# EAGLE design EthernetShield (EAGLE 6.5.0)
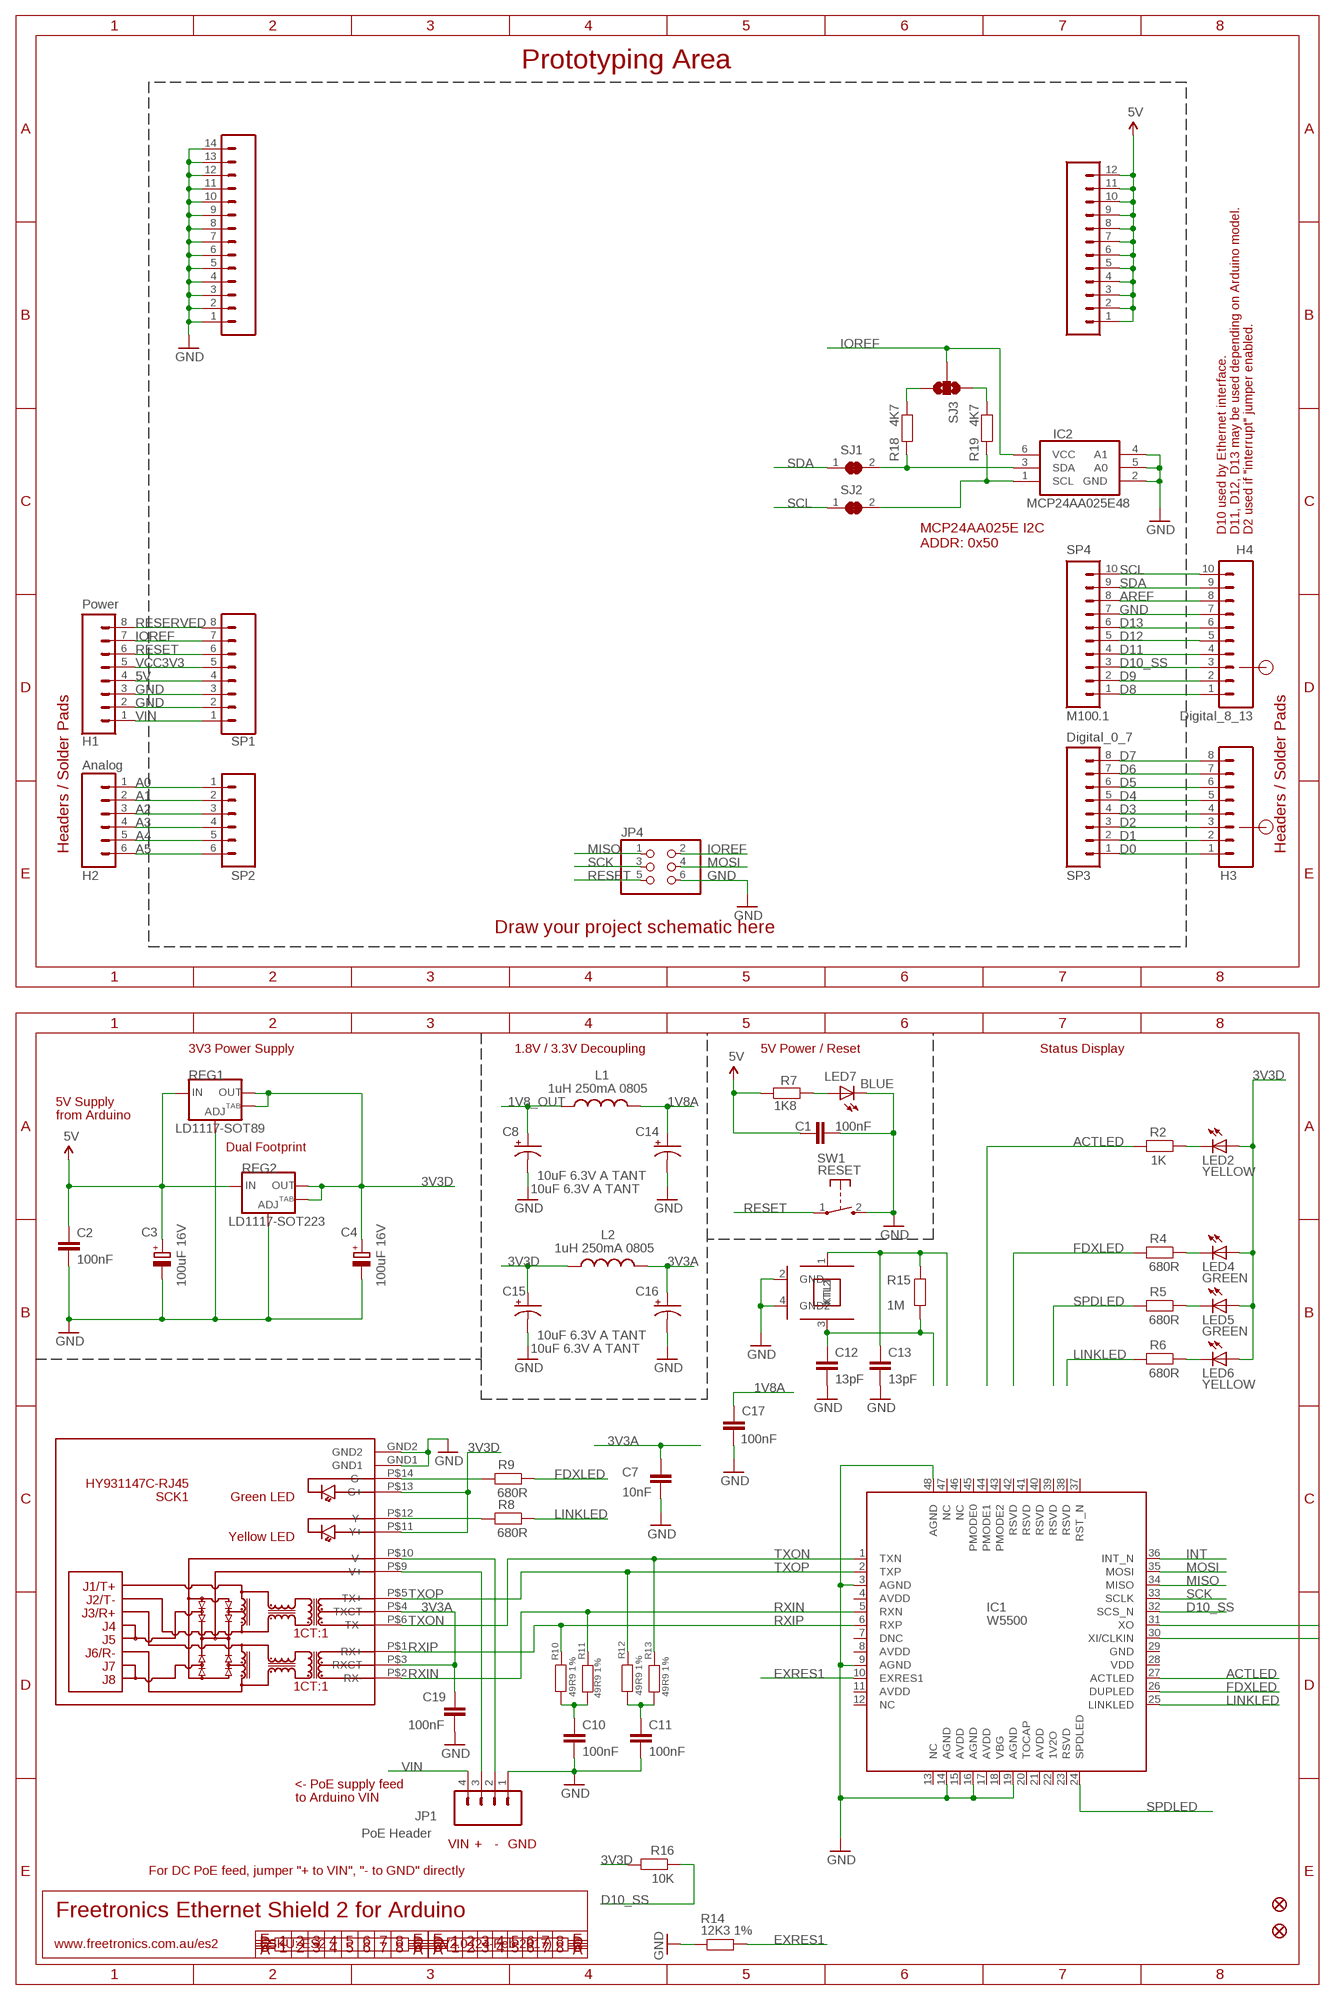
[diagram p0: schematic, sheet 1]

## Parts
C1  100nF  CAP0603  [0603]
C2  100nF  CAP0603  [0603]
C3  100uF 16V  CPOL-EUD  [PANASONIC_D]
C4  100uF 16V  CPOL-EUD  [PANASONIC_D]
C7  10nF  CAP0603  [0603]
C8  10uF 6.3V A TANT  CAP_POL1206  [EIA3216]
C10  100nF  CAP0603  [0603]
C11  100nF  CAP0603  [0603]
C12  13pF  CAP0603  [0603]
C13  13pF  CAP0603  [0603]
C14  10uF 6.3V A TANT  CAP_POL1206  [EIA3216]
C15  10uF 6.3V A TANT  CAP_POL1206  [EIA3216]
C16  10uF 6.3V A TANT  CAP_POL1206  [EIA3216]
C17  100nF  CAP0603  [0603]
C19  100nF  CAP0603  [0603]
H1  Power  M08  [1X08]
H2  Analog  M06SIP  [1X06]
H3  Digital_0_7  M08  [1X08]
H4  Digital_8_13  M100.1  [1X10]
IC1  W5500  [W5500]
IC2  MCP24AA025E48  [SOT23-6]
JP1  PoE Header  M04PTH  [1X04]
JP4  PINHD-2X3  [2X03]
L1  1uH 250mA 0805  L-USL2012C  [L2012C]
L2  1uH 250mA 0805  L-USL2012C  [L2012C]
LED2  YELLOW  LED0603  [LED-0603]
LED4  GREEN  LED0603  [LED-0603]
LED5  GREEN  LED0603  [LED-0603]
LED6  YELLOW  LED0603  [LED-0603]
LED7  BLUE  LED0603  [LED-0603]
PADS_5V  M12PTH  [1X12]
PADS_GND  M14  [1X14]
R2  1K  RESISTOR0603  [0603]
R4  680R  RESISTOR0603  [0603]
R5  680R  RESISTOR0603  [0603]
R6  680R  RESISTOR0603  [0603]
R7  1K8  RESISTOR0603  [0603]
R8  680R  RESISTOR0603  [0603]
R9  680R  RESISTOR0603  [0603]
R10  49R9 1%  RESISTOR0603  [0603]
R11  49R9 1%  RESISTOR0603  [0603]
R12  49R9 1%  RESISTOR0603  [0603]
R13  49R9 1%  RESISTOR0603  [0603]
R14  12K3 1%  RESISTOR0603  [0603]
R15  1M  RESISTOR0603  [0603]
R16  10K  RESISTOR0603  [0603]
R18  4K7  RESISTOR0603  [0603]
R19  4K7  RESISTOR0603  [0603]
REG1  LD1117-SOT89  V_REG_LM1117SOT89  [SOT89]
REG2  LD1117-SOT223  V_REG_LM1117SOT223  [SOT223]
SCK1  HY931147C-RJ45  [HY931147C]
SJ1  SJCN  [SJC]
SJ2  SJCN  [SJC]
SJ3  SOLDERJUMPER_2WAYT  [SJ_2]
SP1  M08  [1X08]
SP2  Analog  M06SIP  [1X06]
SP3  Digital_0_7  M08  [1X08]
SP4  M100.1  [1X10]
SW1  RESET  TAC_SWITCH_2PIN  [TACTILE_SWITCH_SMD_2PIN_TINY]
U$6  FIDUCIAL1X2.5  [FIDUCIAL-1X2.5]
U$8  FIDUCIAL1X2.5  [FIDUCIAL-1X2.5]
XTL1  25MHZ  CRYSTAL-GND3X2  [CRYSTAL-SMD-3X2]

## Nets
1V8_OUT: C8.A(+) L1.1
1V8A: C14.A(+) C17.1 L1.2
3V3A: C7.1 C16.A(+) C19.1 L2.2 SCK1.P$3(RXCT) SCK1.P$4(TXCT)
3V3D: C4.+ C15.A(+) L2.1 LED2.A LED4.A LED5.A LED6.A R16.2 REG1.2(OUT) REG1.4(OUT) REG2.2(OUT) REG2.4(OUT) SCK1.P$11(Y+) SCK1.P$13(G+)
5V: C1.1 C2.1 C3.+ H1.4 PADS_5V.1 PADS_5V.2 PADS_5V.3 PADS_5V.4 PADS_5V.5 PADS_5V.6 PADS_5V.7 PADS_5V.8 PADS_5V.9 PADS_5V.10 PADS_5V.11 PADS_5V.12 R7.1 REG1.3(IN) REG2.3(IN) SP1.4
A0: H2.1 SP2.1
A1: H2.2 SP2.2
A2: H2.3 SP2.3
A3: H2.4 SP2.4
A4: H2.5 SP2.5
A5: H2.6 SP2.6
ACTLED: IC1.27(ACTLED) R2.2
AREF: H4.8 SP4.8
D0: H3.1 SP3.1
D1: H3.2 SP3.2
D2: H3.3 SP3.3
D3: H3.4 SP3.4
D4: H3.5 SP3.5
D5: H3.6 SP3.6
D6: H3.7 SP3.7
D7: H3.8 SP3.8
D8: H4.1 SP4.1
D9: H4.2 SP4.2
D10_SS: H4.3 IC1.32(SCS_N) R16.1 SP4.3
D11: H4.4 SP4.4
D12: H4.5 SP4.5
D13: H4.6 SP4.6
EXRES1: IC1.10(EXRES1) R14.2
FDXLED: IC1.26(DUPLED) R4.2 R9.1
GND: C1.2 C2.2 C3.- C4.- C7.2 C8.C(-) C10.2 C11.2 C12.2 C13.2 C14.C(-) C15.C(-) C16.C(-) C17.2 C19.2 H1.2 H1.3 H4.7 IC1.3(AGND) IC1.9(AGND) IC1.14(AGND) IC1.16(AGND) IC1.19(AGND) IC1.48(AGND) IC2.2(GND) IC2.4(A1) IC2.5(A0) JP1.1 JP4.6 LED7.C PADS_GND.1 PADS_GND.2 PADS_GND.3 PADS_GND.4 PADS_GND.5 PADS_GND.6 PADS_GND.7 PADS_GND.8 PADS_GND.9 PADS_GND.10 PADS_GND.11 PADS_GND.12 PADS_GND.13 PADS_GND.14 R14.1 REG1.1(ADJ) REG2.1(ADJ) SCK1.GND1 SCK1.GND2 SP1.2 SP1.3 SP4.7 SW1.2(S) XTL1.2(GND) XTL1.4(GND2)
INT: IC1.36(INT_N)
IOREF: H1.7 IC2.6(VCC) JP4.2 SJ3.2 SP1.7
LINKLED: IC1.25(LINKLED) R6.2 R8.1
MISO: IC1.34(MISO) JP4.1
MOSI: IC1.35(MOSI) JP4.4
N$1: C11.1 R12.1 R13.2
N$2: IC2.1(SCL) R19.2 SJ2.2
N$6: IC2.3(SDA) R18.2 SJ1.2
N$7: R18.1 SJ3.3
N$53: R19.1 SJ3.1
N$66: IC1.31(XO)
N$67: R9.2 SCK1.P$14(G-)
N$68: JP1.3 SCK1.P$9(V+)
N$69: JP1.2 SCK1.P$10(V-)
N$71: IC1.30(XI/CLKIN)
N$131: LED7.A R7.2
N$321: C10.1 R10.1 R11.2
N$323: LED5.C R5.1
N$325: LED6.C R6.1
N$327: LED4.C R4.1
N$329: LED2.C R2.1
N$332: R8.2 SCK1.P$12(Y-)
RESERVED: H1.8 SP1.8
RESET: H1.6 JP4.5 SP1.6 SW1.1(P)
RXIN: IC1.5(RXN) R11.1 SCK1.P$2(RX-)
RXIP: IC1.6(RXP) R10.2 SCK1.P$1(RX+)
SCK: IC1.33(SCLK) JP4.3
SCL: H4.10 SJ2.1 SP4.10
SDA: H4.9 SJ1.1 SP4.9
SPDLED: IC1.24(SPDLED) R5.2
TXON: IC1.1(TXN) R13.1 SCK1.P$6(TX-)
TXOP: IC1.2(TXP) R12.2 SCK1.P$5(TX+)
VCC3V3: H1.5 SP1.5
VIN: H1.1 JP1.4 SP1.1
XTLN: C13.1 R15.2 XTL1.1(XTL1)
XTLP: C12.1 R15.1 XTL1.3(XTL2)
Unconnected: IC1.4(AVDD) IC1.7(DNC) IC1.8(AVDD) IC1.11(AVDD) IC1.12(NC) IC1.13(NC) IC1.15(AVDD) IC1.17(AVDD) IC1.18(VBG) IC1.20(TOCAP) IC1.21(AVDD) IC1.22(1V2O) IC1.23(RSVD) IC1.28(VDD) IC1.29(GND) IC1.37(RST_N) IC1.38(RSVD) IC1.39(RSVD) IC1.40(RSVD) IC1.41(RSVD) IC1.42(RSVD) IC1.43(PMODE2) IC1.44(PMODE1) IC1.45(PMODE0) IC1.46(NC) IC1.47(NC)

## Notes on the sheet
- Prototyping Area
- D10 used by Ethernet interface. | D11, D12, D13 may be used depending on Arduino model. | D2 used if "interrupt" jumper enabled.
- MCP24AA025E I2C
  ADDR: 0x50
- Headers / Solder Pads | Headers / Solder Pads
- Draw your project schematic here
- 3V3 Power Supply | 1.8V / 3.3V Decoupling | 5V Power / Reset | Status Display
- 5V Supply
- from Arduino
- Dual Footprint
- <- PoE supply feed
- to Arduino VIN
- VIN | + | - | GND
- For DC PoE feed, jumper "+ to VIN", "- to GND" directly
- Freetronics Ethernet Shield 2 for Arduino
- www.freetronics.com.au/es2 | SKU: ES2 | V2.0 (24-Feb-2017)

## Library data of the parts
C1 C2 C7 C10-C13 C17 C19 = freetronics:CAP: Capacitor Standard 0603 ceramic capacitor, and 0.1" leaded capacitor.
C3 C4 = rcl:CPOL-EU: POLARIZED CAPACITOR, European symbol
C8 C14-C16 = freetronics:CAP_POL: Capacitor Polarized These are standard SMD and PTH capacitors. Normally 10uF, 47uF, and 100uF in electrolytic and tantalum varieties. Always verify the external diameter of the through hole cap, it varies with capacity, voltage, and manufacturer. The EIA devices should be standard.
H1 H3 SP1 SP3 = freetronics:M08: Header 8 Standard 8-pin 0.1" header. Use with straight break away headers (SKU : PRT-00116), right angle break away headers (PRT-00553), swiss pins (PRT-00743), machine pins (PRT-00117), and female headers (PRT-00115).
H2 SP2 = freetronics:M06: Header 6 Standard 6-pin 0.1" header. Use with straight break away headers (SKU : PRT-00116), right angle break away headers (PRT-00553), swiss pins (PRT-00743), machine pins (PRT-00117), and female headers (PRT-00115). Molex polarized connector foot print use with SKU : PRT-08094 with associated crimp pins and housings. NOTES ON THE VARIANTS LOCK and LOCK_LONGPADS... This footprint was designed to help hold the alignment of a through-hole component (i.e. 6-pin header) while soldering it into place. You may notice that each hole has been shifted either up or down by 0.005 of an inch from it's more standard position (which is a perfectly straight line). This slight alteration caused the pins (the squares in the middle) to touch the edges of the holes. Because they are alternating, it causes a "brace" to hold the component in place. 0.005 has proven to be the perfect amount of "off-center" position when using our standard breakaway headers. Although looks a little odd when you look at the bare footprint, once you have a header in there, the alteration is very hard to notice. Also, if you push a header all the way into place, it is covered up entirely on the bottom side. This idea of altering the position of holes to aid alignment will be further integrated into the Sparkfun Library for other footprints. It can help hold any component with 3 or more connection pins.
H4 SP4 = freetronics-original:M10: Header 10 Standard 10-pin 0.1" header. Use with straight break away headers (SKU : PRT-00116), right angle break away headers (PRT-00553), swiss pins (PRT-00743), machine pins (PRT-00117), and female headers (PRT-00115).
IC1 = W5500:W5500
IC2 = freetronics-jon:MCP24AA025E48
JP1 = freetronics:M04: Header 4 Standard 4-pin 0.1" header. Use with straight break away headers (SKU : PRT-00116), right angle break away headers (PRT-00553), swiss pins (PRT-00743), machine pins (PRT-00117), and female headers (PRT-00115). Molex polarized connector foot print use with SKU : PRT-08231 with associated crimp pins and housings.
JP4 = freetronics-master-v1.1:PINHD-2X3: PIN HEADER
L1 L2 = rcl:L-US: INDUCTOR, American symbol
LED2 LED4-LED7 = freetronics:LED: LEDs Standard schematic elements and footprints for 5mm, 3mm, 1206, and 0603 sized LEDs. 5mm - Spark Fun Electronics SKU : COM-00529 (and others)
PADS_5V = freetronics-original:M12: Header 12 Standard 12-pin 0.1" header. Use with straight break away headers (SKU : PRT-00116), right angle break away headers (PRT-00553), swiss pins (PRT-00743), machine pins (PRT-00117), and female headers (PRT-00115).
PADS_GND = freetronics:M14: Header 14 Standard 14-pin 0.1" header. Use with straight break away headers (SKU : PRT-00116), right angle break away headers (PRT-00553), swiss pins (PRT-00743), machine pins (PRT-00117), and female headers (PRT-00115).
R2 R4-R16 = freetronics:RESISTOR: Resistor Basic schematic elements and footprints for 0603, 1206, and PTH 1/10th watt (small) resistors.
R18 R19 = freetronics-master-v1.1:RESISTOR: Resistor Basic schematic elements and footprints for 0603, 1206, and PTH 1/10th watt (small) resistors.
REG1 REG2 = freetronics:V_REG_LM1117: Voltage Regulator LD1117 Adjustable low-dropout voltage regulator available in SOT89 and SOT223 SMT packages.
SCK1 = freetronics-jon:HY931147C
SJ1 SJ2 = freetronics-jon:SJC
SJ3 = freetronics-original:SOLDERJUMPER_2WAY: Solder Jumper 2 way solder jumper
SW1 = freetronics-master-v1:TAC_SWITCH_2PIN: Momentary Tactile Switch - 2 pin
U$6 U$8 = freetronics:FIDUCIAL: Fiducial Alignment Points Various fiducial points for machine vision alignment.
XTL1 = freetronics-jon:CRYSTAL-GND

## Board
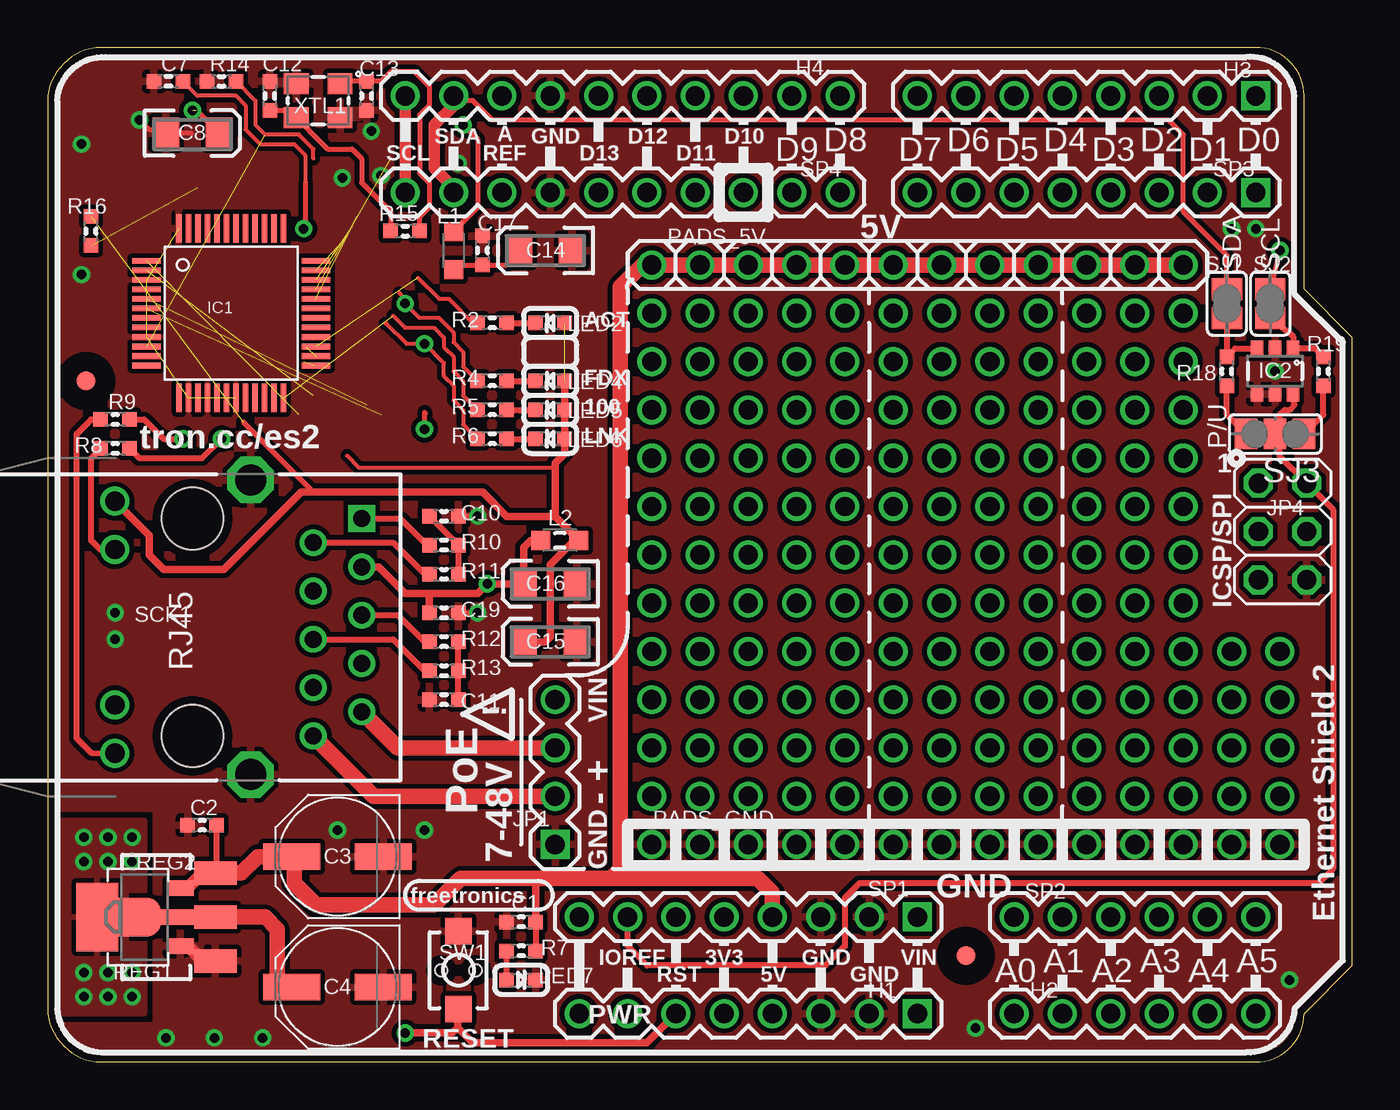
[diagram p1: board, top side]
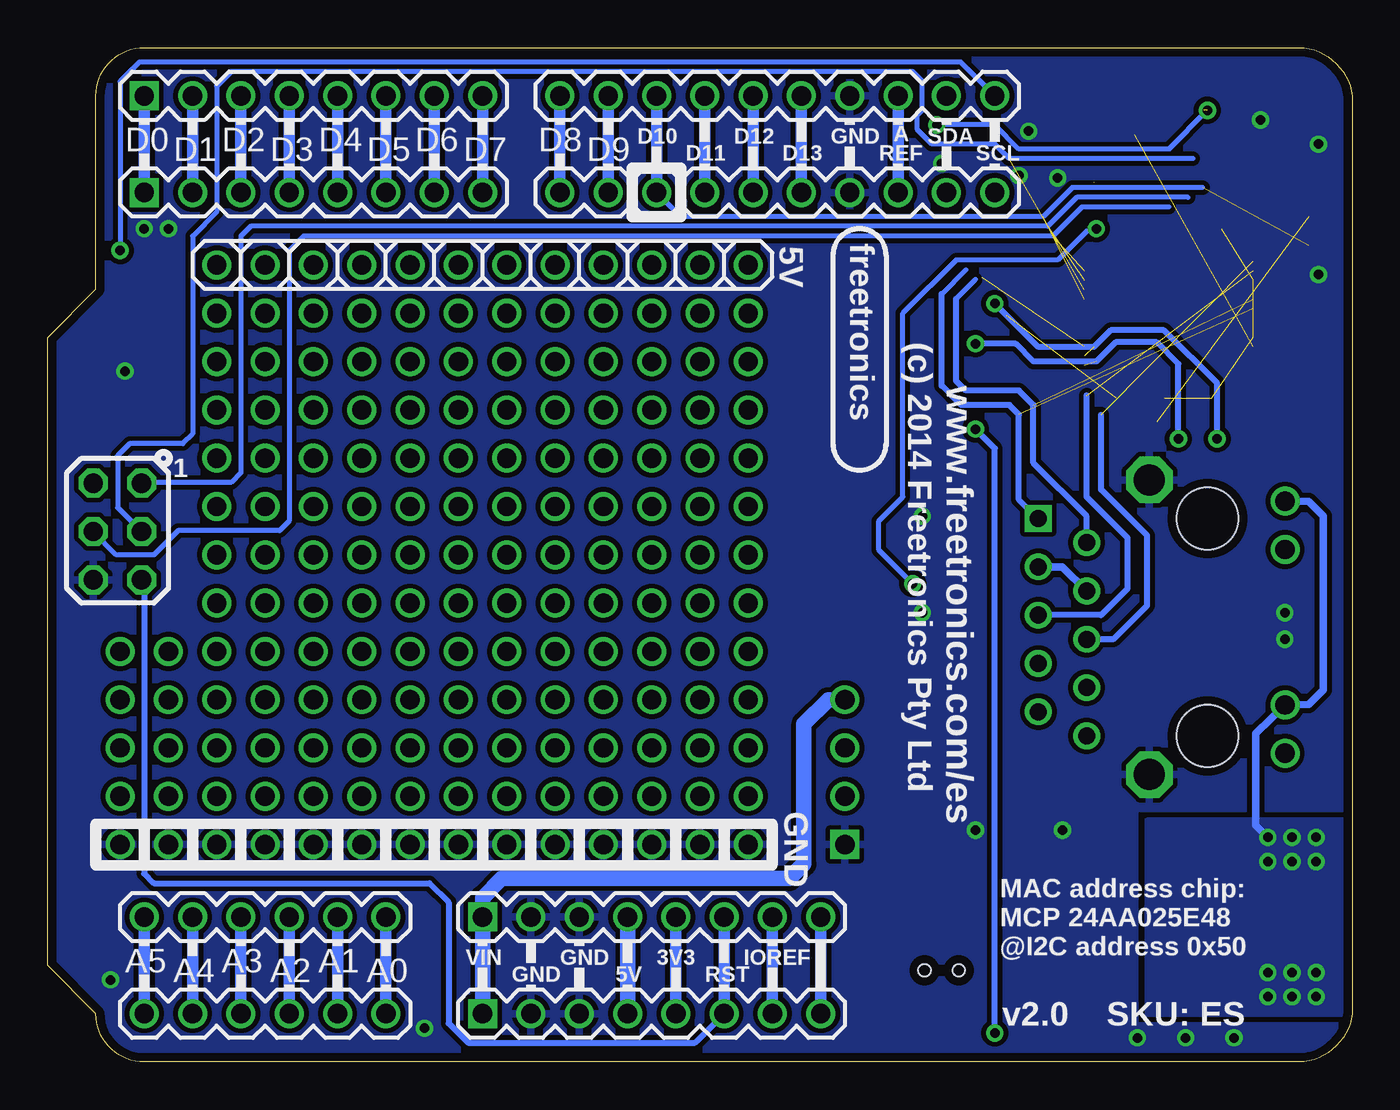
[diagram p2: board, bottom side, seen from below]

Size 68.58 x 53.34 mm. Coordinates in mm from the lower left corner, seen from the top.
Outline: 0,2.54 arc74 2.54,0 63.5,0 arc90 66.04,2.54 68.58,5.08 68.58,38.1 66.04,40.64 66.04,50.8 arc90 63.5,53.34 2.54,53.34 arc74 0,50.8 0,2.54
Copper layers (1*16): Top 0.035mm / dielectric 1.5mm / Bottom 0.035mm
Design rules "default": minimum track width 8mil, minimum drill 18mil, track to track 10mil, track to pad 10mil, pad to pad 10mil, via to via 10mil, smd to smd 8mil, copper to edge 18mil, drill to drill 8mil, minimum pad ring 10mil, minimum via ring 8mil, stop-mask expansion 4mil, vias tented up to drill 25mil, thermal gap 10mil
tRestrict: area 1,34.8 to 3,36.8; area 47.2,4.6 to 49.3,6.6

### Footprints (pad centres in the part's own frame; a part is rotated, then mirrored left to right if it is on the bottom)
0603 = smd 0.762 x 0.762: 1 -0.762,0; 2 0.762,0
PANASONIC_D = smd 3 x 1.4: + 2.4,0; - -2.4,0
EIA3216 = smd 1.4 x 1.6: A 1.4,0; C -1.4,0
1X08 = drill 1.016 square: 1 0,0 | drill 1.016: 2 2.54,0; 3 5.08,0; 4 7.62,0; 5 10.16,0; 6 12.7,0; 7 15.24,0; 8 17.78,0
1X06 = drill 1.016: 1 0,0; 2 2.54,0; 3 5.08,0; 4 7.62,0; 5 10.16,0; 6 12.7,0
1X10 = drill 1.016: 1 0,0; 2 2.54,0; 3 5.08,0; 4 7.62,0; 5 10.16,0; 6 12.7,0; 7 15.24,0; 8 17.78,0; 9 20.32,0; 10 22.86,0
W5500 = smd 1.5 x 0.3: 1 -4.45,2.75; 2 -4.45,2.25; 3 -4.45,1.75; 4 -4.45,1.25; 5 -4.45,0.75; 6 -4.45,0.25; 7 -4.45,-0.25; 8 -4.45,-0.75; 9 -4.45,-1.25; 10 -4.45,-1.75; 11 -4.45,-2.25; 12 -4.45,-2.75; 25 4.45,-2.75; 26 4.45,-2.25; 27 4.45,-1.75; 28 4.45,-1.25; 29 4.45,-0.75; 30 4.45,-0.25; 31 4.45,0.25; 32 4.45,0.75; 33 4.45,1.25; 34 4.45,1.75; 35 4.45,2.25; 36 4.45,2.75 | smd 0.3 x 1.5: 13 -2.75,-4.45; 14 -2.25,-4.45; 15 -1.75,-4.45; 16 -1.25,-4.45; 17 -0.75,-4.45; 18 -0.25,-4.45; 19 0.25,-4.45; 20 0.75,-4.45; 21 1.25,-4.45; 22 1.75,-4.45; 23 2.25,-4.45; 24 2.75,-4.45; 37 2.75,4.45; 38 2.25,4.45; 39 1.75,4.45; 40 1.25,4.45; 41 0.75,4.45; 42 0.25,4.45; 43 -0.25,4.45; 44 -0.75,4.45; 45 -1.25,4.45; 46 -1.75,4.45; 47 -2.25,4.45; 48 -2.75,4.45
SOT23-6 = smd 0.65 x 0.8: 1 -0.95,-1.2; 2 0,-1.2; 3 0.95,-1.2; 4 0.95,1.2; 5 0,1.2; 6 -0.95,1.2
1X04 = drill 1.016 square: 1 0,0 | drill 1.016: 2 2.54,0; 3 5.08,0; 4 7.62,0
2X03 = drill 1.016 octagon: 1 -2.54,-1.27; 2 -2.54,1.27; 3 0,-1.27; 4 0,1.27; 5 2.54,-1.27; 6 2.54,1.27
L2012C = smd 1 x 1: 1 -1,0; 2 1,0
LED-0603 = smd 0.762 x 0.762: A -0.762,0; C 0.762,0
1X12 = drill 1.016: 1 0,0; 2 2.54,0; 3 5.08,0; 4 7.62,0; 5 10.16,0; 6 12.7,0; 7 15.24,0; 8 17.78,0; 9 20.32,0; 10 22.86,0; 11 25.4,0; 12 27.94,0
1X14 = drill 1.016: 1 0,0; 2 2.54,0; 3 5.08,0; 4 7.62,0; 5 10.16,0; 6 12.7,0; 7 15.24,0; 8 17.78,0; 9 20.32,0; 10 22.86,0; 11 25.4,0; 12 27.94,0; 13 30.48,0; 14 33.02,0
SOT89 = smd 0.8 x 1.4: 1 -1.524,-1.905; 3 1.524,-1.905 | smd 0.8 x 1.9: 2 0,-1.651 | smd 2.032 x 3.65: 4 0,0.94
SOT223 = smd 1.219 x 2.235: 1 -2.311,-3.099; 2 0,-3.099; 3 2.311,-3.099 | smd 3.6 x 2.2: 4 0,3.099
HY931147C = drill 1.63 octagon: GND1 3.05,7.745; GND2 3.05,-7.745 | drill 0.9 square: P$1 8.89,5.715 | drill 0.9: P$2 6.35,4.445; P$3 8.89,3.175; P$4 6.35,1.905; P$5 8.89,0.635; P$6 6.35,-0.635; P$7 8.89,-1.905; P$8 6.35,-3.175; P$9 8.89,-4.445; P$10 6.35,-5.715 | drill 1.016: P$11 -4.08,6.625; P$12 -4.08,4.085; P$13 -4.08,-4.085; P$14 -4.08,-6.625 | hole 3.25: 0,5.715; 0,-5.715
SJC = smd 1.168 x 1.6: 1 -0.762,0; 2 0.762,0
SJ_2 = smd 1.168 x 1.6: 1 -1.524,0; 2 0,0; 3 1.524,0
TACTILE_SWITCH_SMD_2PIN_TINY = smd 1.4 x 1.4: 1 -2.05,0; 2 2.05,0 | hole 0.65: 0,0.9; 0,-0.9
FIDUCIAL-1X2.5 = smd 1 x 1: 1 0,0
CRYSTAL-SMD-3X2 = smd 1.3 x 1.1: 1 -1.15,-0.9; 2 1.15,-0.9; 3 1.15,0.9; 4 -1.15,0.9

### Placement (x,y rotation side)
C1  24.89,7.37 180 top
C2  8.13,12.45 180 top
C3  15.24,10.79 180 top
C4  15.24,3.94 180 top
C7  6.35,51.56 180 top
C8  7.62,48.84 0 top
C10  20.83,28.7 0 top
C11  20.83,19.05 180 top
C12  11.68,50.8 90 top
C13  16.76,50.8 270 top
C14  26.16,42.67 180 top
C15  26.42,22.1 180 top
C16  26.42,25.15 180 top
C17  22.86,42.67 90 top
C19  20.83,23.62 0 top
H1  45.72,2.54 180 top
H2  50.8,2.54 0 top
H3  63.5,50.8 180 top
H4  41.66,50.8 180 top
IC1  9.65,39.37 0 top
IC2  64.52,36.32 180 top
JP1  26.67,11.43 90 top
JP4  64.91,27.89 270 top
L1  21.34,42.67 270 top
L2  26.92,27.43 180 top
LED2  26.42,38.86 180 top
LED4  26.42,35.81 180 top
LED5  26.42,34.29 180 top
LED6  26.42,32.77 180 top
LED7  24.89,4.32 0 top
PADS_5V  31.75,41.91 0 top
PADS_GND  31.75,11.43 0 top
R2  23.37,38.86 180 top
R4  23.37,35.81 180 top
R5  23.37,34.29 180 top
R6  23.37,32.77 180 top
R7  24.89,5.84 180 top
R8  3.56,32.26 180 top
R9  3.56,33.78 180 top
R10  20.83,27.18 180 top
R11  20.83,25.65 0 top
R12  20.83,22.1 180 top
R13  20.83,20.57 0 top
R14  9.14,51.56 0 top
R15  18.8,43.69 0 top
R16  2.29,43.69 90 top
R18  61.98,36.32 90 top
R19  67.06,36.32 90 top
REG1  5.08,7.62 90 top
REG2  5.71,7.62 90 top
SCK1  7.62,22.86 0 top
SJ1  61.98,39.88 270 top
SJ2  64.26,39.88 270 top
SJ3  64.52,33.02 180 top
SP1  45.72,7.62 180 top
SP2  50.8,7.62 0 top
SP3  63.5,45.72 180 top
SP4  41.66,45.72 180 top
SW1  21.59,4.83 90 top
U$6  2.03,35.81 0 top
U$8  48.26,5.59 90 top
XTL1  14.22,50.55 180 top

### Tracks (layer width: path | path; a pad name or v marks a point on that pad's centre or on a via)
1V8_OUT  (via drill 0.5)  (1 unrouted)
  Top 0.254: L1.1 21.34,43.69 22.61,44.96 22.61,48.51 v21.84,49.28 | 9.4,48.51 9.58,49.09 C8.A | 7.83,50.04 C8.A | 9.14,48.72 C8.A
  Bottom 0.254: v21.84,49.28 18.8,49.28 17.53,48.01 9.65,48.01 v7.62,50.04
1V8A
  Top 0.203: 21.59,41.91 21.57,41.91 L1.2
  Top 0.254: 20.96,42.04 21.59,41.91 C17.1 24.13,41.91 C14.A
3V3A  (via drill 0.5)  (1 unrouted)
  Top 0.203: 13.56,46.27 13.56,47.65 12.95,48.26 11.18,48.26 10.41,49.02 10.41,50.29 9.91,50.8 7.87,50.8 C7.1
  Top 0.254: 13.56,46.24 13.56,44.22 v13.46,43.81
  Top 0.406: L2.2 25.4,27.43 25.02,27.05 C16.A v23.11,25.15 22.61,24.64 20.07,24.64 | SCK1.P$3 17.4,26.04 18.8,24.64 20.07,24.64 | 20.07,24.64 C19.1
  Bottom 0.254: v23.11,25.15 24.89,26.92 24.89,28.45 23.62,29.72 23.62,39.37 20.83,42.16 15.49,42.16 13.97,43.69 v13.46,43.81
  Bottom 0.406: SCK1.P$4 15.24,26.04 SCK1.P$3
3V3D  (via drill 0.5)  (2 unrouted)
  Top 0.203: 26.67,31.24 16.38,31.24 15.75,31.88
  Top 0.254: 13.97,29.97 10.29,33.66
  Top 0.406: LED4.A LED5.A LED6.A 27.18,32 26.67,31.5 26.67,31.24 26.67,28.69 | REG1.4 REG1.2 REG2.2 | C15.A 26.16,22.1 26.42,22.35 26.42,26.16 27.69,27.43 L2.1 26.67,28.69 | SCK1.P$11 5.33,27.69 5.33,26.67 6.1,25.91 9.27,25.91 13.34,29.97 13.97,29.97 22.86,29.97 24.15,28.69 26.67,28.69
  Top 0.813: C4.+ 12.06,3.81 12.06,6.99 11.43,7.62 REG2.2
  Bottom 0.406: v4.45,11.81 5.08,12.45 5.08,17.27 SCK1.P$13 2.29,18.8 1.52,19.56 1.52,28.7 2.29,29.46 SCK1.P$11
  other vias: 1.91,11.81 1.91,3.43 4.45,3.43 1.91,10.54 1.91,4.7 4.45,10.54 4.45,4.7 3.17,3.43 3.17,4.7 3.17,10.54 3.17,11.81
  pour Top: 0,12.7 5.08,12.7 5.08,2.54 0,2.54
  pour Bottom: 0,12.7 10.79,12.7 10.79,2.54 0,2.54
5V
  Top 0.254: 7.11,8.89 7.37,8.89 8.13,9.65 | 7.11,9.14 7.87,9.91
  Top 0.305: C2.1 8.89,10.41 8.81,10.41 REG2.3 | C1.1 R7.1 | C3.+ 12.95,10.79 | REG1.3 7.11,9.14 7.11,8.89
  Top 0.406: REG1.3 REG2.3 | C1.1 25.65,9.65
  Top 0.61: 31.24,9.65 30.48,10.41 | 29.46,9.65 30.23,10.41
  Top 0.813: REG2.3 10.19,9.93 11.05,10.79 C3.+ | PADS_5V.12 PADS_5V.11 PADS_5V.10 PADS_5V.9 PADS_5V.8 PADS_5V.7 PADS_5V.6 PADS_5V.5 PADS_5V.4 PADS_5V.3 PADS_5V.2 PADS_5V.1 31.24,41.91 30.1,40.77 30.1,9.65 | SP1.4 38.1,8.89 37.34,9.65 31.24,9.65 30.1,9.65 | 30.1,9.65 29.46,9.65 25.65,9.65 21.72,9.65 20.32,8.26 14.1,8.26 12.95,9.4 12.95,10.79
  Bottom 0.813: SP1.4 H1.4
A0
  Bottom 0.61: H2.1 SP2.1
A1
  Bottom 0.61: H2.2 SP2.2
A2
  Bottom 0.61: H2.3 SP2.3
A3
  Bottom 0.61: H2.4 SP2.4
A4
  Bottom 0.61: H2.5 SP2.5
A5
  Bottom 0.61: H2.6 SP2.6
ACTLED  (1 unrouted)
  Top 0.203: R2.2 22.35,38.86 21.08,40.13 20.57,40.13 19.46,41.24
AREF
  Bottom 0.61: SP4.8 H4.8
D0
  Bottom 0.61: SP3.1 H3.1
D1
  Bottom 0.61: SP3.2 H3.2
D2
  Bottom 0.61: SP3.3 H3.3
D3
  Bottom 0.61: SP3.4 H3.4
D4
  Bottom 0.61: SP3.5 H3.5
D5
  Bottom 0.61: SP3.6 H3.6
D6
  Bottom 0.61: SP3.7 H3.7
D7
  Bottom 0.61: SP3.8 H3.8
D8
  Bottom 0.61: SP4.1 H4.1
D9
  Bottom 0.61: SP4.2 H4.2
D10_SS  (2 unrouted)
  Bottom 0.254: SP4.3 35.31,44.45 16.26,44.45 14.73,45.97 7.87,45.97
  Bottom 0.61: SP4.3 H4.3
D11
  Bottom 0.61: H4.4 SP4.4
D12
  Bottom 0.61: H4.5 SP4.5
D13
  Bottom 0.61: SP4.6 H4.6
EXRES1  (1 unrouted)
  Top 0.203: 13.97,47.5 13.97,48.01 13.21,48.77 11.43,48.77 10.92,49.28 10.92,50.55 R14.2
FDXLED  (via drill 0.5)  (1 unrouted)
  Top 0.203: 18.49,40.44 18.8,40.13 v18.8,39.88 19.56,39.12 20.57,39.12 21.34,38.35 21.34,37.85 21.84,37.34 21.84,36.58 R4.2
  Top 0.305: R9.1 5.08,33.78 6.1,32.77 v7.11,32.77
  Bottom 0.305: v7.11,32.77 7.11,35.69 9.91,38.48 12.7,38.48 13.59,37.59 16.51,37.59 v18.8,39.88
GND  (via drill 0.5)  (5 unrouted)
  Top 0.254: 7.56,48.83 C8.C 5.33,49.02 v4.83,49.53 | 7.37,6.1 7.11,6.1 | 7.37,6.1 7.62,6.1 8.13,5.59 | 7.37,6.1 7.37,5.84 7.87,5.33 | C10.2 v22.61,28.7 | C19.2 v22.61,23.62
  other vias: 8.76,1.27 6.22,1.27 11.3,1.27 65.28,4.32 48.77,1.78 15.24,12.19 17.02,48.95 1.78,48.26 1.78,41.4 63.5,43.81 62.23,43.81 3.56,23.62 3.56,22.23 19.81,12.19 21.59,47.24 15.49,46.48 17.53,46.61 64.52,36.32
  pour Bottom: 0,50.8 arc-74 2.54,53.34 63.5,53.34 arc-74 66.04,50.8 66.04,40.64 68.58,38.1 68.58,5.08 66.04,2.54 arc-74 63.5,0 2.54,0 arc-74 0,1.91 11.43,1.91 11.43,13.34 0,13.34
  pour Top: 0,50.8 arc-74 2.54,53.34 63.5,53.34 arc-74 66.04,50.8 66.04,40.64 68.58,38.1 68.58,5.08 66.04,2.54 arc-74 63.5,0 2.54,0 arc-74 0,1.91 5.71,1.91 5.71,13.34 0,13.34
IOREF
  Top 0.305: SP1.7 30.48,6.1 31.5,5.08 40.89,5.08 41.91,6.1 41.91,8.64 42.67,9.4 66.8,9.4 67.56,10.16 67.56,29.05 JP4.2 64.77,31.84 64.77,32.51 64.52,32.77 SJ3.2 64.77,33.27 64.77,34.04 65.02,34.29 65.28,34.29 65.53,34.54 65.53,35.12 IC2.6
  Bottom 0.61: H1.7 SP1.7
LINKLED  (via drill 0.5)  (1 unrouted)
  Top 0.203: R6.2 21.84,33.53 21.84,34.29 21.34,34.8 21.34,35.56 20.83,36.07 20.83,36.75 v19.81,37.77 18.87,37.77 17.8,38.84 17.75,38.84
  Top 0.305: R8.1 4.83,31.75 8.13,31.75 v9.14,32.77
  Bottom 0.305: v9.14,32.77 9.14,36.7 10.29,37.85 12.45,37.85 13.46,36.83 16.76,36.83 17.7,37.77 v19.81,37.77
MISO  (1 unrouted)
  Bottom 0.254: 63.59,30.48 58.93,30.48 58.42,30.99 58.42,43.43 57.91,43.94 16,43.94 14.48,45.47 8.64,45.47
  Bottom 0.305: 63.59,30.48 JP4.1
MOSI  (1 unrouted)
  Bottom 0.254: JP4.4 64.96,26.67 62.99,26.67 61.72,27.94 56.39,27.94 55.88,28.45 55.88,42.67 55.12,43.43 15.75,43.43 14.22,44.96 9.65,44.96
N$1
  Top 0.305: R12.1 R13.2 C11.1
N$2
  Top 0.305: SJ2.2 65.47,38.17 IC2.1 66.62,37.52 R19.2
N$3  (via drill 1.02)
  other vias: 36.83,13.97
N$4  (via drill 1.02)
  other vias: 34.29,13.97
N$5  (via drill 1.02)
  other vias: 59.69,13.97
N$6
  Top 0.305: SJ1.2 R18.2 62.41,37.52 IC2.3
N$7
  Top 0.305: R18.1 61.98,34.04 SJ3.3 64.52,33.02
N$8  (via drill 1.02)
  other vias: 54.61,13.97
N$9  (via drill 1.02)
  other vias: 52.07,13.97
N$10  (via drill 1.02)
  other vias: 49.53,13.97
N$11  (via drill 1.02)
  other vias: 46.99,13.97
N$12  (via drill 1.02)
  other vias: 44.45,13.97
N$13  (via drill 1.02)
  other vias: 41.91,13.97
N$14  (via drill 1.02)
  other vias: 39.37,13.97
N$15  (via drill 1.02)
  other vias: 31.75,13.97
N$16  (via drill 1.02)
  other vias: 39.37,21.59
N$17  (via drill 1.02)
  other vias: 54.61,24.13
N$18  (via drill 1.02)
  other vias: 31.75,21.59
N$19  (via drill 1.02)
  other vias: 36.83,16.51
N$20  (via drill 1.02)
  other vias: 34.29,16.51
N$21  (via drill 1.02)
  other vias: 31.75,16.51
N$22  (via drill 1.02)
  other vias: 59.69,16.51
N$23  (via drill 1.02)
  other vias: 57.15,16.51
N$24  (via drill 1.02)
  other vias: 54.61,16.51
N$25  (via drill 1.02)
  other vias: 52.07,16.51
N$26  (via drill 1.02)
  other vias: 49.53,16.51
N$27  (via drill 1.02)
  other vias: 46.99,16.51
N$28  (via drill 1.02)
  other vias: 44.45,16.51
N$29  (via drill 1.02)
  other vias: 41.91,16.51
N$30  (via drill 1.02)
  other vias: 39.37,16.51
N$31  (via drill 1.02)
  other vias: 36.83,21.59
N$32  (via drill 1.02)
  other vias: 44.45,21.59
N$33  (via drill 1.02)
  other vias: 57.15,24.13
N$34  (via drill 1.02)
  other vias: 36.83,19.05
N$35  (via drill 1.02)
  other vias: 34.29,19.05
N$36  (via drill 1.02)
  other vias: 31.75,19.05
N$37  (via drill 1.02)
  other vias: 36.83,24.13
N$38  (via drill 1.02)
  other vias: 59.69,19.05
N$39  (via drill 1.02)
  other vias: 57.15,19.05
N$40  (via drill 1.02)
  other vias: 54.61,19.05
N$41  (via drill 1.02)
  other vias: 52.07,19.05
N$42  (via drill 1.02)
  other vias: 49.53,19.05
N$43  (via drill 1.02)
  other vias: 46.99,19.05
N$44  (via drill 1.02)
  other vias: 44.45,19.05
N$45  (via drill 1.02)
  other vias: 41.91,19.05
N$46  (via drill 1.02)
  other vias: 39.37,19.05
N$47  (via drill 1.02)
  other vias: 57.15,13.97
N$48  (via drill 1.02)
  other vias: 44.45,24.13
N$49  (via drill 1.02)
  other vias: 57.15,21.59
N$50  (via drill 1.02)
  other vias: 34.29,26.67
N$51  (via drill 1.02)
  other vias: 34.29,24.13
N$52  (via drill 1.02)
  other vias: 34.29,21.59
N$53
  Top 0.305: R19.1 67.06,34.04 SJ3.1 64.52,33.02
N$56  (via drill 1.02)
  other vias: 54.61,21.59
N$57  (via drill 1.02)
  other vias: 52.07,21.59
N$58  (via drill 1.02)
  other vias: 49.53,21.59
N$59  (via drill 1.02)
  other vias: 46.99,21.59
N$62  (via drill 1.02)
  other vias: 36.83,26.67
N$67
  Top 0.305: SCK1.P$14 2.29,16.26 1.52,17.02 1.52,33.02 2.29,33.78 R9.2
N$68
  Top 0.813: SCK1.P$9 18.41,16.51 JP1.3
N$69
  Top 0.813: JP1.2 17.14,13.97 SCK1.P$10
N$74  (via drill 1.02)
  other vias: 49.53,24.13
N$75  (via drill 1.02)
  other vias: 31.75,26.67
N$81  (via drill 1.02)
  other vias: 31.75,24.13
N$82  (via drill 1.02)
  other vias: 36.83,29.21
N$83  (via drill 1.02)
  other vias: 34.29,29.21
N$84  (via drill 1.02)
  other vias: 31.75,29.21
N$85  (via drill 1.02)
  other vias: 36.83,31.75
N$87  (via drill 1.02)
  other vias: 57.15,26.67
N$88  (via drill 1.02)
  other vias: 54.61,26.67
N$89  (via drill 1.02)
  other vias: 52.07,26.67
N$90  (via drill 1.02)
  other vias: 49.53,26.67
N$91  (via drill 1.02)
  other vias: 46.99,26.67
N$98  (via drill 1.02)
  other vias: 34.29,31.75
N$99  (via drill 1.02)
  other vias: 31.75,31.75
N$100  (via drill 1.02)
  other vias: 36.83,34.29
N$101  (via drill 1.02)
  other vias: 34.29,34.29
N$102  (via drill 1.02)
  other vias: 59.69,29.21
N$103  (via drill 1.02)
  other vias: 57.15,29.21
N$104  (via drill 1.02)
  other vias: 54.61,29.21
N$105  (via drill 1.02)
  other vias: 52.07,29.21
N$106  (via drill 1.02)
  other vias: 49.53,29.21
N$107  (via drill 1.02)
  other vias: 46.99,29.21
N$108  (via drill 1.02)
  other vias: 44.45,29.21
N$109  (via drill 1.02)
  other vias: 41.91,29.21
N$110  (via drill 1.02)
  other vias: 39.37,29.21
N$111  (via drill 1.02)
  other vias: 31.75,34.29
N$112  (via drill 1.02)
  other vias: 41.91,26.67
N$114  (via drill 1.02)
  other vias: 36.83,36.83
N$115  (via drill 1.02)
  other vias: 34.29,36.83
N$116  (via drill 1.02)
  other vias: 31.75,36.83
N$117  (via drill 1.02)
  other vias: 36.83,39.37
N$118  (via drill 1.02)
  other vias: 59.69,31.75
N$119  (via drill 1.02)
  other vias: 57.15,31.75
N$120  (via drill 1.02)
  other vias: 54.61,31.75
N$121  (via drill 1.02)
  other vias: 52.07,31.75
N$122  (via drill 1.02)
  other vias: 49.53,31.75
N$123  (via drill 1.02)
  other vias: 46.99,31.75
N$124  (via drill 1.02)
  other vias: 44.45,31.75
N$125  (via drill 1.02)
  other vias: 41.91,31.75
N$126  (via drill 1.02)
  other vias: 39.37,31.75
N$127  (via drill 1.02)
  other vias: 34.29,39.37
N$128  (via drill 1.02)
  other vias: 41.91,24.13
N$130  (via drill 1.02)
  other vias: 31.75,39.37
N$131
  Top 0.305: LED7.A R7.2
N$134  (via drill 1.02)
  other vias: 59.69,34.29
N$135  (via drill 1.02)
  other vias: 57.15,34.29
N$136  (via drill 1.02)
  other vias: 54.61,34.29
N$137  (via drill 1.02)
  other vias: 52.07,34.29
N$138  (via drill 1.02)
  other vias: 49.53,34.29
N$139  (via drill 1.02)
  other vias: 46.99,34.29
N$140  (via drill 1.02)
  other vias: 44.45,34.29
N$141  (via drill 1.02)
  other vias: 41.91,34.29
N$142  (via drill 1.02)
  other vias: 39.37,34.29
N$144  (via drill 1.02)
  other vias: 41.91,21.59
N$145  (via drill 1.02)
  other vias: 44.45,26.67
N$150  (via drill 1.02)
  other vias: 59.69,36.83
N$151  (via drill 1.02)
  other vias: 57.15,36.83
N$152  (via drill 1.02)
  other vias: 54.61,36.83
N$153  (via drill 1.02)
  other vias: 52.07,36.83
N$154  (via drill 1.02)
  other vias: 49.53,36.83
N$155  (via drill 1.02)
  other vias: 46.99,36.83
N$156  (via drill 1.02)
  other vias: 44.45,36.83
N$157  (via drill 1.02)
  other vias: 41.91,36.83
N$158  (via drill 1.02)
  other vias: 39.37,36.83
N$160  (via drill 1.02)
  other vias: 39.37,26.67
N$161  (via drill 1.02)
  other vias: 52.07,24.13
N$166  (via drill 1.02)
  other vias: 59.69,39.37
N$167  (via drill 1.02)
  other vias: 57.15,39.37
N$168  (via drill 1.02)
  other vias: 54.61,39.37
N$169  (via drill 1.02)
  other vias: 52.07,39.37
N$170  (via drill 1.02)
  other vias: 49.53,39.37
N$171  (via drill 1.02)
  other vias: 46.99,39.37
N$172  (via drill 1.02)
  other vias: 44.45,39.37
N$173  (via drill 1.02)
  other vias: 41.91,39.37
N$174  (via drill 1.02)
  other vias: 39.37,39.37
N$176  (via drill 1.02)
  other vias: 39.37,24.13
N$177  (via drill 1.02)
  other vias: 46.99,24.13
N$182  (via drill 1.02)
  other vias: 62.23,13.97
N$183  (via drill 1.02)
  other vias: 62.23,16.51
N$184  (via drill 1.02)
  other vias: 62.23,19.05
N$188  (via drill 1.02)
  other vias: 62.23,21.59
N$193  (via drill 1.02)
  other vias: 64.77,13.97
N$194  (via drill 1.02)
  other vias: 64.77,16.51
N$195  (via drill 1.02)
  other vias: 64.77,19.05
N$196  (via drill 1.02)
  other vias: 64.77,21.59
N$197  (via drill 1.02)
  other vias: 59.69,21.59
N$198  (via drill 1.02)
  other vias: 59.69,24.13
N$199  (via drill 1.02)
  other vias: 59.69,26.67
N$321
  Top 0.305: R11.2 R10.1 C10.1
N$323
  Top 0.305: R5.1 LED5.C
N$325
  Top 0.305: R6.1 LED6.C
N$327
  Top 0.305: R4.1 LED4.C
N$329
  Top 0.305: R2.1 LED2.C
N$332
  Top 0.305: SCK1.P$12 2.79,26.92 2.29,27.43 2.29,31.75 R8.2
RESERVED
  Bottom 0.61: SP1.8 H1.8
RESET  (via drill 0.5)
  Top 0.254: 19.86,34.12 19.81,34.16 v19.81,33.27
  Top 0.406: H1.6 31.5,1.02 22.33,1.02 21.55,1.8 | 21.55,1.8 SW1.1 | v18.8,1.52 21.28,1.52 21.55,1.8
  Bottom 0.305: v18.8,1.52 18.8,32.26 v19.81,33.27 | JP4.5 63.5,25.35 63.5,9.91 62.99,9.4 48.51,9.4 47.5,8.38 47.5,2.03 46.48,1.02 34.54,1.02 H1.6
  Bottom 0.61: H1.6 SP1.6
RXIN  (1 unrouted)
  Top 0.305: R11.1 19.81,25.65 18.16,27.3 SCK1.P$2
  Bottom 0.254: 20.83,40.13 19.81,41.15
  Bottom 0.305: 20.83,40.13 20.83,35.81 20.32,35.31 17.53,35.31 16.76,34.54 16.76,31.5 13.97,28.7 SCK1.P$2
RXIP  (1 unrouted)
  Top 0.305: SCK1.P$1 18.54,28.57 19.94,27.18 R10.2
  Bottom 0.254: 20.32,41.66 21.59,40.39
  Bottom 0.305: 21.59,40.39 21.59,35.56 20.57,34.54 18.03,34.54 17.53,34.04 17.53,29.57 SCK1.P$1
SCK  (1 unrouted)
  Bottom 0.254: 8.38,47.5 18.03,47.5 18.8,48.26 22.1,48.26 22.86,49.02 22.86,49.78 22.61,50.04 22.61,51.56 23.11,52.07 58.93,52.07 59.69,51.31 59.69,44.7 60.96,43.43 60.96,33.02 61.47,32.51 64.26,32.51 64.9,31.88 64.9,29.15 JP4.3
SCL  (via drill 0.5)
  Top 0.254: v64.77,42.67 SJ2.1
  Top 0.61: SP4.10 H4.10
  Bottom 0.254: H4.10 20.57,52.58 63.75,52.58 64.77,51.56 v64.77,42.67
SDA
  Top 0.254: SJ1.1 61.98,42.42 59.69,44.7 59.69,48.77 58.93,49.53 23.37,49.53 22.35,50.55 21.59,50.55 H4.9
  Top 0.61: SP4.9 21.34,45.97 20.32,46.99 20.32,49.28 21.34,50.29 H4.9
SPDLED  (1 unrouted)
  Top 0.203: R5.2 21.84,35.05 21.84,35.81 21.34,36.32 21.34,37.08 20.83,37.59 20.83,38.1 20.32,38.61 18.8,38.61 18.16,39.24
TXON  (1 unrouted)
  Top 0.305: SCK1.P$6 18.16,22.23 19.81,20.57 R13.1
  Bottom 0.305: 13.21,34.04 13.21,30.1 10.79,27.69 10.79,24 12.57,22.23 SCK1.P$6
TXOP  (1 unrouted)
  Top 0.305: SCK1.P$5 18.41,23.5 19.81,22.1 R12.2
  Bottom 0.305: 13.97,35.05 13.97,29.72 11.81,27.56 11.81,24.89 13.21,23.5 SCK1.P$5
VCC3V3
  Bottom 0.61: H1.5 SP1.5
VIN
  Bottom 0.813: H1.1 SP1.1 45.72,8.64 44.7,9.65 29.59,9.65 28.83,10.41 28.83,17.78 27.56,19.05 JP1.4
XTLN
  Top 0.254: R15.2 19.56,44.45 20.07,44.96 20.07,46.23 19.56,46.74 19.56,49.78 20.07,50.29 20.07,51.31 19.3,52.07 18.03,52.07 17.53,51.56 C13.1 15.77,51.56 XTL1.1
XTLP
  Top 0.254: R15.1 18.03,44.7 16.51,46.23 16.51,47.5 16,48.01 14.73,48.01 12.7,50.04 12.68,50.04 | C12.1 12.68,50.04 | 12.68,50.04 XTL1.3

### Text on the board
tPlace: SDA | A | GND | D12 | D10 | D8 | D6 | D4 | D2 | D0 | SCL | REF | D13 | D11 | D9 | D7 | D5 | D3 | D1 | 5V | SDA | SCL | ACT | FDX | 100 | LNK | tron.cc/es2 | P/U | 1 | ICSP/SPI | ! | VIN | - + | PoE | 7-48V | GND | GND | freetronics | Ethernet Shield 2 | IOREF | 3V3 | GND | VIN | A1 | A3 | A5 | RST | 5V | GND | A0 | A2 | A4 | PWR | RESET
bPlace: SDA | A | GND | D12 | D10 | D8 | D6 | D4 | D2 | D0 | SCL | REF | D13 | D11 | D9 | D7 | D5 | D3 | D1 | freetronics | 5V | (c) 2014 Freetronics Pty Ltd | www.freetronics.com/es | 1 | GND | MAC address chip: / MCP 24AA025E48 / @I2C address 0x50 | IOREF | 3V3 | GND | VIN | A1 | A3 | A5 | RST | 5V | GND | A0 | A2 | A4 | v2.0 SKU: ES
tNames: SCK1 | SW1
tDocu: - | + | 1 | + | - | 1 | + | - | + | - | - | + | + | -